# EAGLE schematic harp expander (EAGLE 9.5.1)
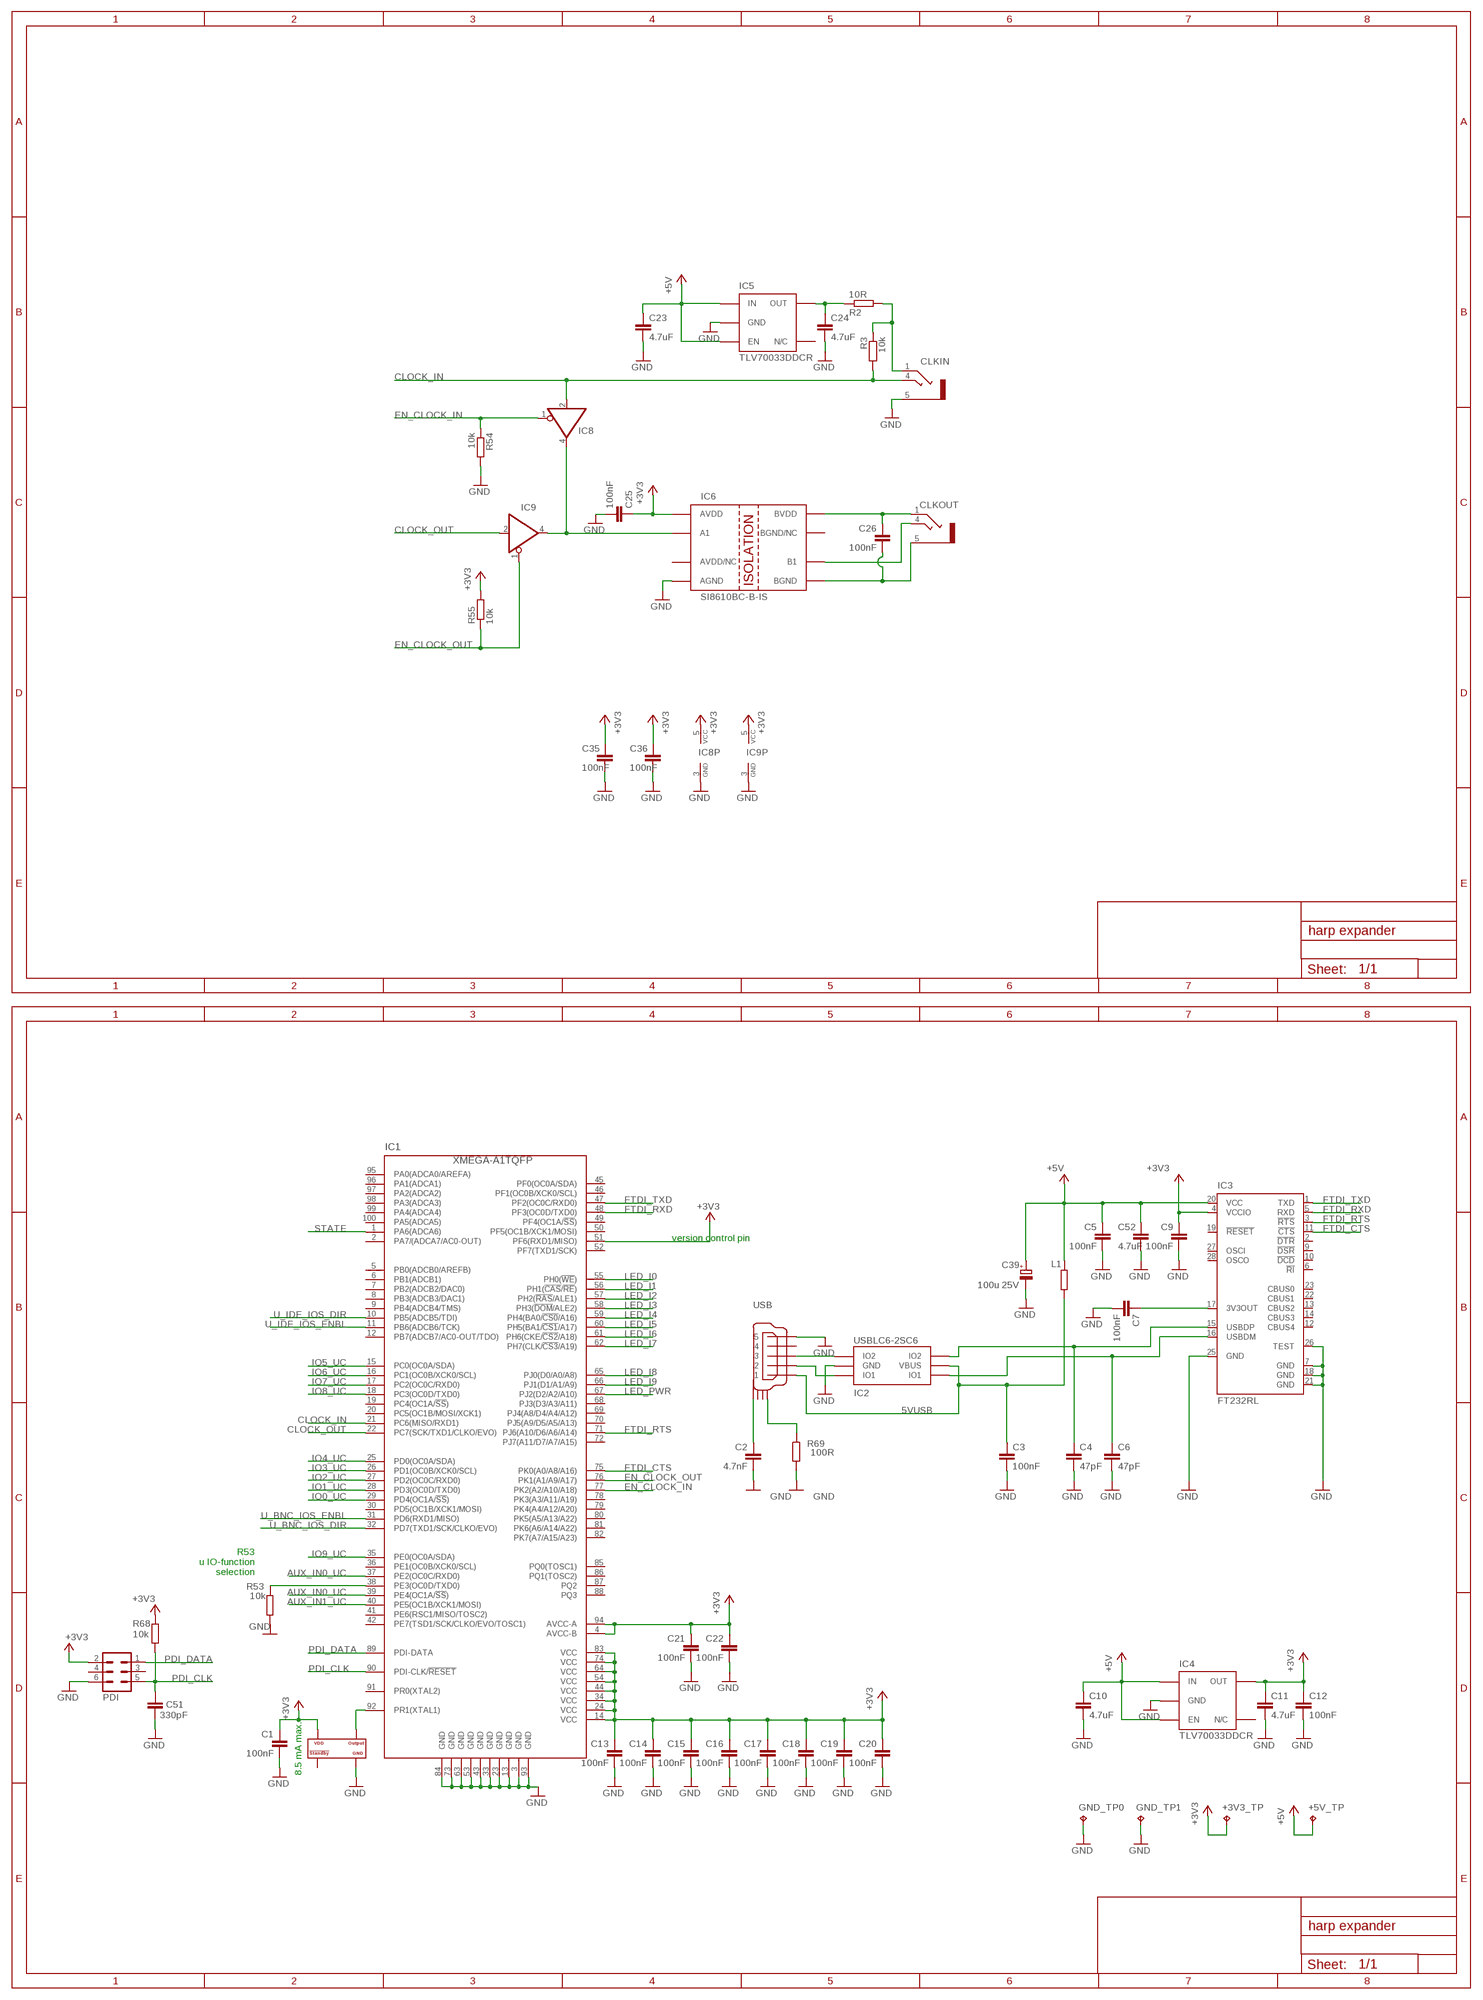
[diagram p0: schematic, sheet 1, part 1 of 2]
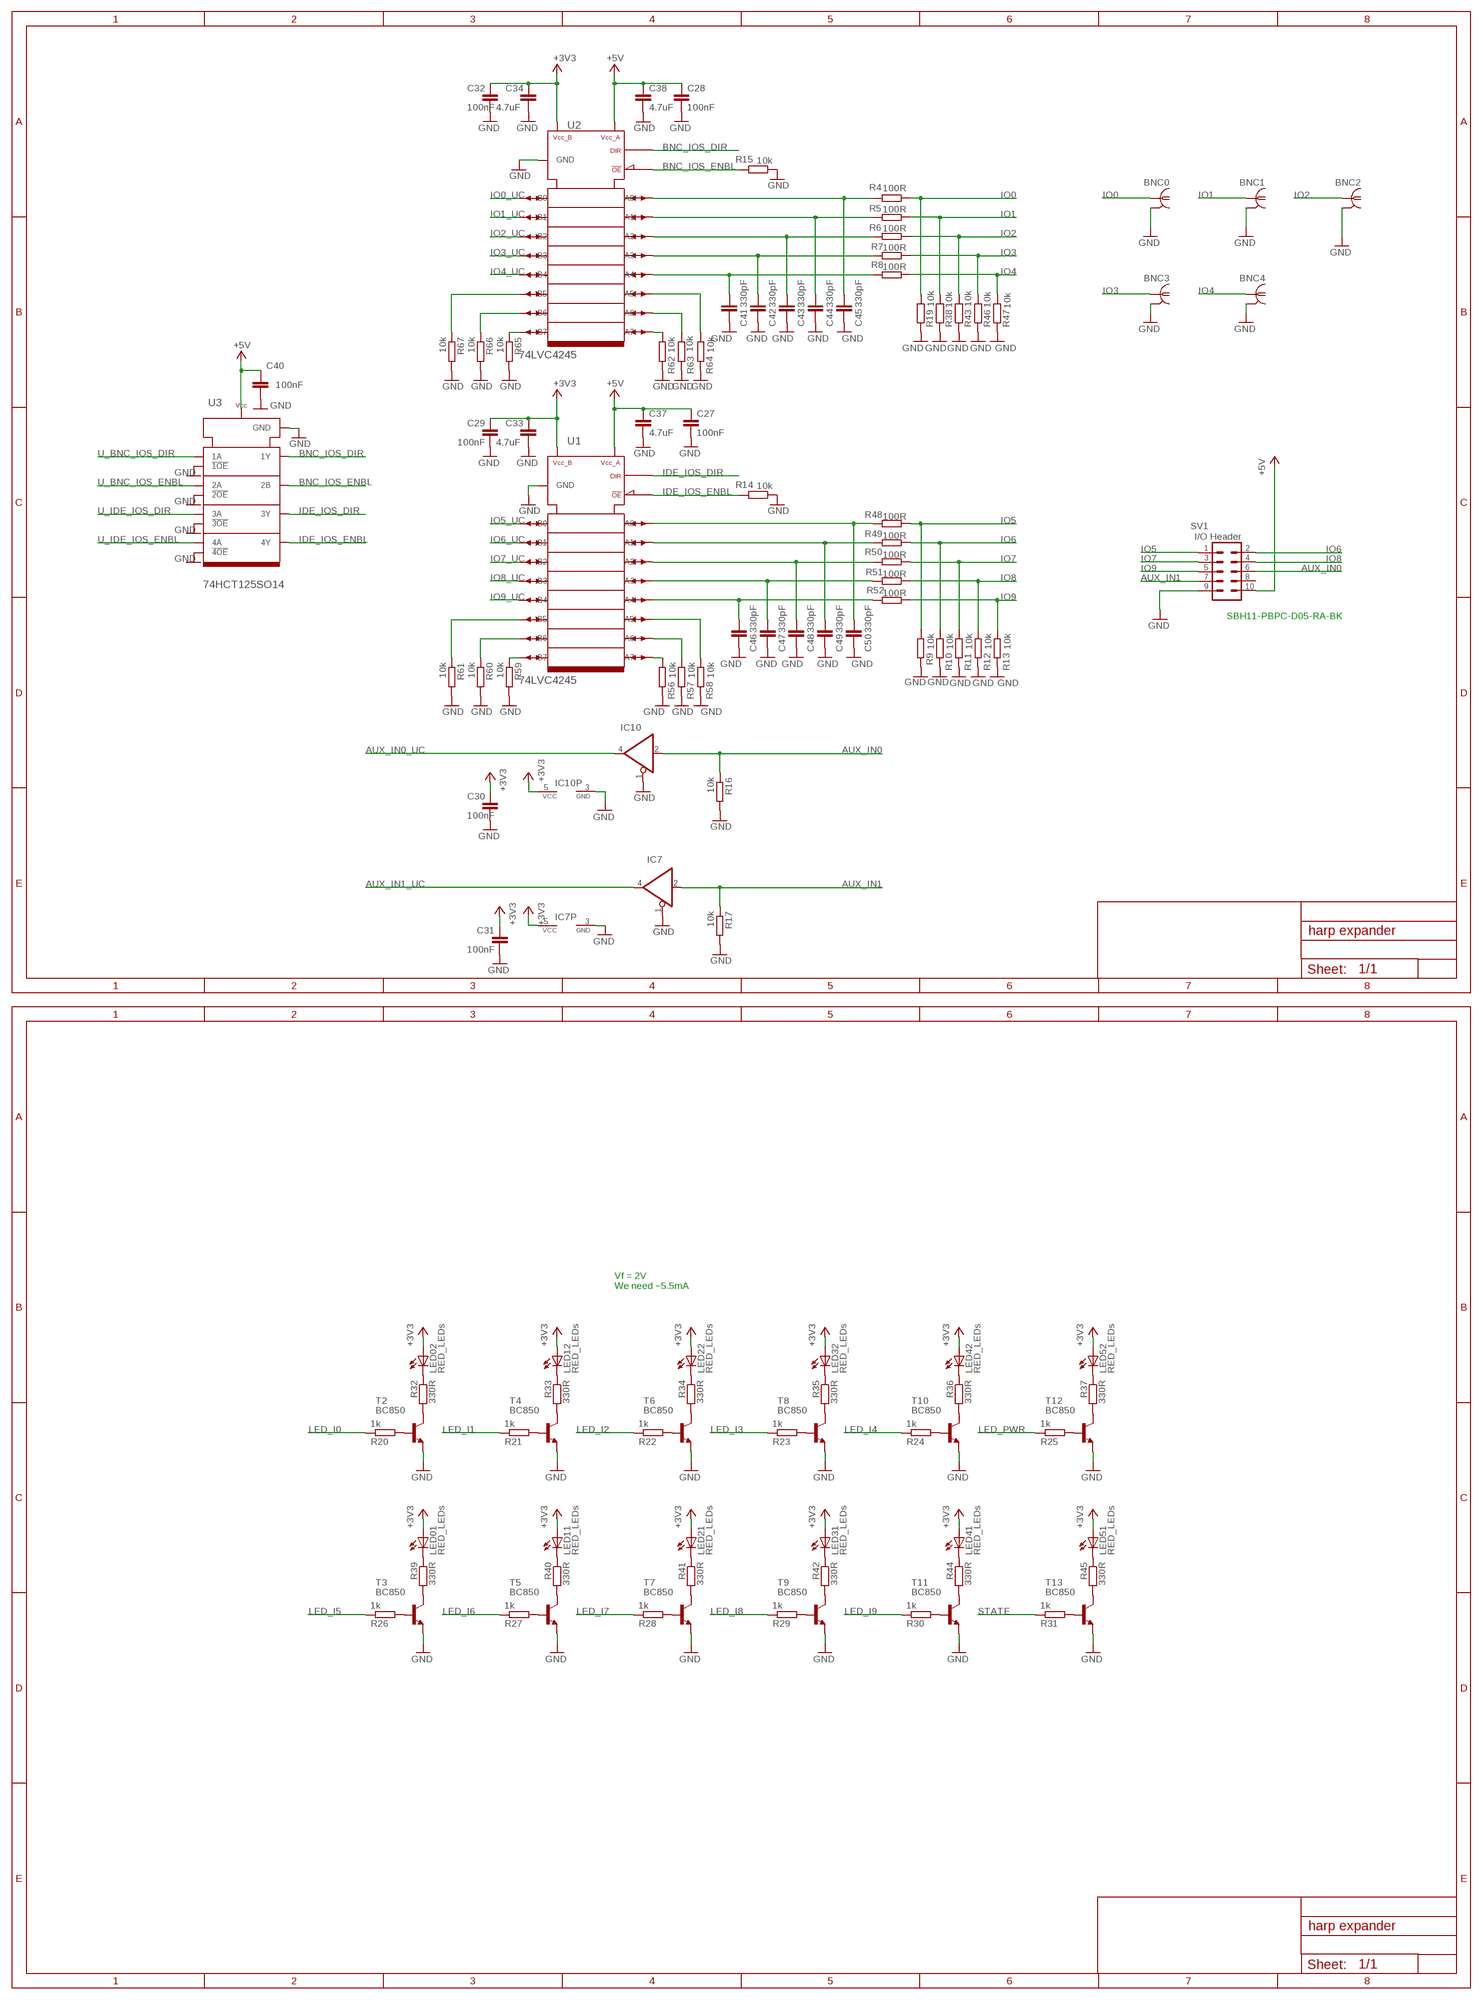
[diagram p1: schematic, sheet 1, part 2 of 2]

## Parts
+3V3_TP  TPPAD1-13  [P1-13]
+5V_TP  TPPAD1-13  [P1-13]
BNC0  BNC plug  BNC_0731000105  [0731000105]
BNC1  BNC plug  BNC_0731000105  [0731000105]
BNC2  BNC plug  BNC_0731000105  [0731000105]
BNC3  BNC plug  BNC_0731000105  [0731000105]
BNC4  BNC plug  BNC_0731000105  [0731000105]
C1  100nF  C-EUC0402  [C0402]
C2  4.7nF  C-EUC0402  [C0402]
C3  100nF  C-EUC0402  [C0402]
C4  47pF  C-EUC0402  [C0402]
C5  100nF  C-EUC0402  [C0402]
C6  47pF  C-EUC0402  [C0402]
C7  100nF  C-EUC0402  [C0402]
C9  100nF  C-EUC0402  [C0402]
C10  4.7uF  C-EUC0603  [C0603]
C11  4.7uF  C-EUC0603  [C0603]
C12  100nF  C-EUC0402  [C0402]
C13  100nF  C-EUC0402  [C0402]
C14  100nF  C-EUC0402  [C0402]
C15  100nF  C-EUC0402  [C0402]
C16  100nF  C-EUC0402  [C0402]
C17  100nF  C-EUC0402  [C0402]
C18  100nF  C-EUC0402  [C0402]
C19  100nF  C-EUC0402  [C0402]
C20  100nF  C-EUC0402  [C0402]
C21  100nF  C-EUC0402  [C0402]
C22  100nF  C-EUC0402  [C0402]
C23  4.7uF  C-EUC0603  [C0603]
C24  4.7uF  C-EUC0603  [C0603]
C25  100nF  C-EUC0402  [C0402]
C26  100nF  C-EUC0402  [C0402]
C27  100nF  C-EUC0402  [C0402]
C28  100nF  C-EUC0402  [C0402]
C29  100nF  C-EUC0402  [C0402]
C30  100nF  C-EUC0402  [C0402]
C31  100nF  C-EUC0402  [C0402]
C32  100nF  C-EUC0402  [C0402]
C33  4.7uF  C-EUC0603  [C0603]
C34  4.7uF  C-EUC0603  [C0603]
C35  100nF  C-EUC0402  [C0402]
C36  100nF  C-EUC0402  [C0402]
C37  4.7uF  C-EUC0603  [C0603]
C38  4.7uF  C-EUC0603  [C0603]
C39  100u 25V  CPOL-EUTT2D6  [TT2D6]
C40  100nF  C-EUC0402  [C0402]
C41  330pF  C-EUC0402  [C0402]
C42  330pF  C-EUC0402  [C0402]
C43  330pF  C-EUC0402  [C0402]
C44  330pF  C-EUC0402  [C0402]
C45  330pF  C-EUC0402  [C0402]
C46  330pF  C-EUC0402  [C0402]
C47  330pF  C-EUC0402  [C0402]
C48  330pF  C-EUC0402  [C0402]
C49  330pF  C-EUC0402  [C0402]
C50  330pF  C-EUC0402  [C0402]
C51  330pF  C-EUC0402  [C0402]
C52  4.7uF  C-EUC0603  [C0603]
CLKIN  CLCK_JACK  STEREO_JACK  [35RASMT2BHNTRX]
CLKOUT  CLCK_JACK  STEREO_JACK  [35RASMT2BHNTRX]
GND_TP0  TPPAD1-13  [P1-13]
GND_TP1  TPPAD1-13  [P1-13]
IC1  XMEGA-A1TQFP  [TQFP100]
IC2  USBLC6-2SC6  USBLC6-2  [SOT23-6L]
IC3  FT232RL  [SSOP28]
IC4  TLV70033DDCR  TLV700XX  [TSOT23-5]
IC5  TLV70033DDCR  TLV700XX  [TSOT23-5]
IC6  SI8610BC-B-IS  SI8610  [SO-08]
IC7  SN74LVC1G125DBVT  74AHC1G125DBV  [SOT23-5]
IC8  SN74LVC1G125DBVT  74AHC1G125DBV  [SOT23-5]
IC9  SN74LVC1G125DBVT  74AHC1G125DBV  [SOT23-5]
IC10  SN74LVC1G125DBVT  74AHC1G125DBV  [SOT23-5]
L1  40R@100MHz  R-EU_R0805  [R0805]
LED0  RED_LEDs  LED_2X_VERTICAL  [569-011X-X00_LED_ARRAY]
LED1  RED_LEDs  LED_2X_VERTICAL  [569-011X-X00_LED_ARRAY]
LED2  RED_LEDs  LED_2X_VERTICAL  [569-011X-X00_LED_ARRAY]
LED3  RED_LEDs  LED_2X_VERTICAL  [569-011X-X00_LED_ARRAY]
LED4  RED_LEDs  LED_2X_VERTICAL  [569-011X-X00_LED_ARRAY]
LED5  RED_LEDs  LED_2X_VERTICAL  [569-011X-X00_LED_ARRAY]
OSC  Oscillator  OSCILLATOR  [OSCILLATOR_3.2X2.5]
PDI  PROG HEADER  MA03-2  [MA03-2]
R2  10R  R-EU_R0402  [R0402]
R3  10k  R-EU_R0402  [R0402]
R4  100R  R-EU_R0603  [R0603]
R5  100R  R-EU_R0603  [R0603]
R6  100R  R-EU_R0603  [R0603]
R7  100R  R-EU_R0603  [R0603]
R8  100R  R-EU_R0603  [R0603]
R9  10k  R-EU_R0402  [R0402]
R10  10k  R-EU_R0402  [R0402]
R11  10k  R-EU_R0402  [R0402]
R12  10k  R-EU_R0402  [R0402]
R13  10k  R-EU_R0402  [R0402]
R14  10k  R-EU_R0402  [R0402]
R15  10k  R-EU_R0402  [R0402]
R16  10k  R-EU_R0402  [R0402]
R17  10k  R-EU_R0402  [R0402]
R19  10k  R-EU_R0402  [R0402]
R20  1k  R-EU_R0402  [R0402]
R21  1k  R-EU_R0402  [R0402]
R22  1k  R-EU_R0402  [R0402]
R23  1k  R-EU_R0402  [R0402]
R24  1k  R-EU_R0402  [R0402]
R25  1k  R-EU_R0402  [R0402]
R26  1k  R-EU_R0402  [R0402]
R27  1k  R-EU_R0402  [R0402]
R28  1k  R-EU_R0402  [R0402]
R29  1k  R-EU_R0402  [R0402]
R30  1k  R-EU_R0402  [R0402]
R31  1k  R-EU_R0402  [R0402]
R32  330R  R-EU_R0402  [R0402]
R33  330R  R-EU_R0402  [R0402]
R34  330R  R-EU_R0402  [R0402]
R35  330R  R-EU_R0402  [R0402]
R36  330R  R-EU_R0402  [R0402]
R37  330R  R-EU_R0402  [R0402]
R38  10k  R-EU_R0402  [R0402]
R39  330R  R-EU_R0402  [R0402]
R40  330R  R-EU_R0402  [R0402]
R41  330R  R-EU_R0402  [R0402]
R42  330R  R-EU_R0402  [R0402]
R43  10k  R-EU_R0402  [R0402]
R44  330R  R-EU_R0402  [R0402]
R45  330R  R-EU_R0402  [R0402]
R46  10k  R-EU_R0402  [R0402]
R47  10k  R-EU_R0402  [R0402]
R48  100R  R-EU_R0603  [R0603]
R49  100R  R-EU_R0603  [R0603]
R50  100R  R-EU_R0603  [R0603]
R51  100R  R-EU_R0603  [R0603]
R52  100R  R-EU_R0603  [R0603]
R53  10k  R-EU_R0402  [R0402]
R54  10k  R-EU_R0402  [R0402]
R55  10k  R-EU_R0402  [R0402]
R56  10k  R-EU_R0402  [R0402]
R57  10k  R-EU_R0402  [R0402]
R58  10k  R-EU_R0402  [R0402]
R59  10k  R-EU_R0402  [R0402]
R60  10k  R-EU_R0402  [R0402]
R61  10k  R-EU_R0402  [R0402]
R62  10k  R-EU_R0402  [R0402]
R63  10k  R-EU_R0402  [R0402]
R64  10k  R-EU_R0402  [R0402]
R65  10k  R-EU_R0402  [R0402]
R66  10k  R-EU_R0402  [R0402]
R67  10k  R-EU_R0402  [R0402]
R68  10k  R-EU_R0402  [R0402]
R69  100R  R-EU_R0603  [R0603]
SV1  I/O Header  ML10L  [ML10L]
T2  BC850  [SOT23]
T3  BC850  [SOT23]
T4  BC850  [SOT23]
T5  BC850  [SOT23]
T6  BC850  [SOT23]
T7  BC850  [SOT23]
T8  BC850  [SOT23]
T9  BC850  [SOT23]
T10  BC850  [SOT23]
T11  BC850  [SOT23]
T12  BC850  [SOT23]
T13  BC850  [SOT23]
U1  744245X  [SO24L]
U2  744245X  [SO24L]
U3  74HCT125SO14  [SO14]
USB  mini USB  USB_MINI_B  [240-0002-1]

## Nets
5VUSB: C3.1 IC2.P$5(VBUS) L1.2 USB.P$1
+3V3: +3V3_TP.TP C1.1 C9.1 C11.1 C12.1 C13.1 C14.1 C15.1 C16.1 C17.1 C18.1 C19.1 C20.1 C21.1 C22.1 C25.1 C29.1 C30.1 C31.1 C32.1 C33.1 C34.1 C35.1 C36.1 IC1.4(AVCC-B) IC1.14(VCC) IC1.24(VCC) IC1.34(VCC) IC1.44(VCC) IC1.51(PF6(RXD1/MISO)) IC1.54(VCC) IC1.64(VCC) IC1.74(VCC) IC1.83(VCC) IC1.94(AVCC-A) IC3.4(VCCIO) IC4.5(OUT) IC6.1(AVDD) IC7.5(VCC) IC8.5(VCC) IC9.5(VCC) IC10.5(VCC) LED0.A1(1:A) LED0.A2(2:A) LED1.A1(1:A) LED1.A2(2:A) LED2.A1(1:A) LED2.A2(2:A) LED3.A1(1:A) LED3.A2(2:A) LED4.A1(1:A) LED4.A2(2:A) LED5.A1(1:A) LED5.A2(2:A) OSC.P$4(VDD) PDI.2 R55.2 R68.2 U1.23(VCC_B) U1.24(VCC_B) U2.23(VCC_B) U2.24(VCC_B)
+5V: +5V_TP.TP C5.1 C10.1 C23.1 C27.1 C28.1 C37.1 C38.1 C39.+ C40.1 C52.1 IC3.20(VCC) IC4.1(IN) IC4.3(EN) IC5.1(IN) IC5.3(EN) L1.1 SV1.10 U1.1(VCC_A) U2.1(VCC_A) U3.14(VCC)
AUX_IN0: IC10.2(I) R16.1 SV1.6
AUX_IN0_UC: IC1.37(PE2(OC0C/RXD0)) IC1.39(PE4(OC1A/!SS!)) IC10.4(O)
AUX_IN1: IC7.2(I) R17.1 SV1.7
AUX_IN1_UC: IC1.40(PE5(OC1B/XCK1/MOSI)) IC7.4(O)
BNC_IOS_DIR: U2.2(DIR) U3.3(1Y)
BNC_IOS_ENBL: R15.2 U2.22(OE) U3.6(2B)
CLOCK_IN: CLKIN.4 IC1.21(PC6(MISO/RXD1)) IC8.2(I) R3.2
CLOCK_OUT: IC1.22(PC7(SCK/TXD1/CLKO/EVO)) IC9.2(I)
EN_CLOCK_IN: IC1.77(PK2(A2/A10/A18)) IC8.1(OE) R54.1
EN_CLOCK_OUT: IC1.76(PK1(A1/A9/A17)) IC9.1(OE) R55.1
FTDI_CTS: IC1.75(PK0(A0/A8/A16)) IC3.11(!CTS)
FTDI_RTS: IC1.71(PJ6(A10/D6/A6/A14)) IC3.3(!RTS)
FTDI_RXD: IC1.48(PF3(OC0D/TXD0)) IC3.5(RXD)
FTDI_TXD: IC1.47(PF2(OC0C/RXD0)) IC3.1(TXD)
GND: BNC0.2 BNC0.3 BNC1.2 BNC1.3 BNC2.2 BNC2.3 BNC3.2 BNC3.3 BNC4.2 BNC4.3 C1.2 C2.2 C3.2 C4.2 C5.2 C6.2 C7.2 C9.2 C10.2 C11.2 C12.2 C13.2 C14.2 C15.2 C16.2 C17.2 C18.2 C19.2 C20.2 C21.2 C22.2 C23.2 C24.2 C25.2 C27.2 C28.2 C29.2 C30.2 C31.2 C32.2 C33.2 C34.2 C35.2 C36.2 C37.2 C38.2 C39.- C40.2 C41.2 C42.2 C43.2 C44.2 C45.2 C46.2 C47.2 C48.2 C49.2 C50.2 C51.2 C52.2 CLKIN.5 GND_TP0.TP GND_TP1.TP IC1.3(GND) IC1.13(GND) IC1.23(GND) IC1.33(GND) IC1.43(GND) IC1.53(GND) IC1.63(GND) IC1.73(GND) IC1.84(GND) IC1.93(GND) IC2.P$2(GND) IC3.7(GND) IC3.18(GND) IC3.21(GND) IC3.25(GND) IC3.26(TEST) IC4.2(GND) IC5.2(GND) IC6.4(AGND) IC7.1(OE) IC7.3(GND) IC8.3(GND) IC9.3(GND) IC10.1(OE) IC10.3(GND) OSC.P$2(GND) PDI.6 R9.2 R10.2 R11.2 R12.2 R13.2 R14.1 R15.1 R16.2 R17.2 R19.1 R38.1 R43.1 R46.1 R47.1 R53.2 R54.2 R56.2 R57.2 R58.2 R59.2 R60.2 R61.2 R62.2 R63.2 R64.2 R65.2 R66.2 R67.2 R69.2 SV1.9 T2.2(E) T3.2(E) T4.2(E) T5.2(E) T6.2(E) T7.2(E) T8.2(E) T9.2(E) T10.2(E) T11.2(E) T12.2(E) T13.2(E) U1.11(GND) U1.12(GND) U1.13(GND) U2.11(GND) U2.12(GND) U2.13(GND) U3.1(!1OE) U3.4(!2OE) U3.7(GND) U3.10(!3OE) U3.13(!4OE) USB.P$5
GND_ISO: C26.2 CLKOUT.5 IC6.5(BGND)
IDE_IOS_DIR: U1.2(DIR) U3.8(3Y)
IDE_IOS_ENBL: R14.2 U1.22(OE) U3.11(4Y)
IO0 [IOss]: BNC0.1 R4.1 R19.2
IO0_UC: IC1.29(PD4(OC1A/!SS!)) U2.21(B0)
IO1 [IOss]: BNC1.1 R5.1 R38.2
IO1_UC: IC1.28(PD3(OC0D/TXD0)) U2.20(B1)
IO2 [IOss]: BNC2.1 R6.1 R43.2
IO2_UC: IC1.27(PD2(OC0C/RXD0)) U2.19(B2)
IO3 [IOss]: BNC3.1 R7.1 R46.2
IO3_UC: IC1.26(PD1(OC0B/XCK0/SCL)) U2.18(B3)
IO4 [IOss]: BNC4.1 R8.1 R47.2
IO4_UC: IC1.25(PD0(OC0A/SDA)) U2.17(B4)
IO5 [IOss]: R9.1 R48.1 SV1.1
IO5_UC: IC1.15(PC0(OC0A/SDA)) U1.21(B0)
IO6 [IOss]: R10.1 R49.1 SV1.2
IO6_UC: IC1.16(PC1(OC0B/XCK0/SCL)) U1.20(B1)
IO7 [IOss]: R11.1 R50.1 SV1.3
IO7_UC: IC1.17(PC2(OC0C/RXD0)) U1.19(B2)
IO8 [IOss]: R12.1 R51.1 SV1.4
IO8_UC: IC1.18(PC3(OC0D/TXD0)) U1.18(B3)
IO9 [IOss]: R13.1 R52.1 SV1.5
IO9_UC: IC1.35(PE0(OC0A/SDA)) U1.17(B4)
LED_I0: IC1.55(PH0(!WE!)) R20.1
LED_I1: IC1.56(PH1(!CAS!/!RE!)) R21.1
LED_I2: IC1.57(PH2(!RAS!/ALE1)) R22.1
LED_I3: IC1.58(PH3(!DOM!/ALE2)) R23.1
LED_I4: IC1.59(PH4(BA0/!CS0!/A16)) R24.1
LED_I5: IC1.60(PH5(BA1/!CS1!/A17)) R26.1
LED_I6: IC1.61(PH6(CKE/!CS2!/A18)) R27.1
LED_I7: IC1.62(PH7(CLK/!CS3!/A19)) R28.1
LED_I8: IC1.65(PJ0(D0/A0/A8)) R29.1
LED_I9: IC1.66(PJ1(D1/A1/A9)) R30.1
LED_PWR: IC1.67(PJ2(D2/A2/A10)) R25.1
N$1: R24.2 T10.1(B)
N$2: CLKOUT.4 IC6.6(B1)
N$3: R20.2 T2.1(B)
N$4: LED0.C2(2:C) R32.1
N$5: C26.1 CLKOUT.1 IC6.8(BVDD)
N$6 [IOss]: C50.1 R48.2 U1.3(A0)
N$7: R36.2 T10.3(C)
N$8: R32.2 T2.3(C)
N$9: IC1.38(PE3(OC0D/TXD0)) R53.1
N$14: R26.2 T3.1(B)
N$15: R22.2 T6.1(B)
N$16: R39.2 T3.3(C)
N$17: R21.2 T4.1(B)
N$18: LED3.C1(1:C) R42.1
N$19: R33.2 T4.3(C)
N$20: R27.2 T5.1(B)
N$21: R34.2 T6.3(C)
N$22: R40.2 T5.3(C)
N$23: LED3.C2(2:C) R35.1
N$24: R28.2 T7.1(B)
N$25: R41.2 T7.3(C)
N$26: R23.2 T8.1(B)
N$27: R35.2 T8.3(C)
N$28: R29.2 T9.1(B)
N$29: R42.2 T9.3(C)
N$30: LED1.C2(2:C) R33.1
N$31: LED2.C2(2:C) R34.1
N$32: LED1.C1(1:C) R40.1
N$33: LED2.C1(1:C) R41.1
N$34: R30.2 T11.1(B)
N$36: LED0.C1(1:C) R39.1
N$38: C7.1 IC3.17(3V3OUT)
N$40: IC2.P$1(IO1) USB.P$2
N$41: CLKIN.1 R2.2 R3.1
N$42: C24.1 IC5.5(OUT) R2.1
N$43: IC6.2(A1) IC8.4(O) IC9.4(O)
N$47: R44.2 T11.3(C)
N$50: IC2.P$3(IO2) USB.P$3
N$53: R25.2 T12.1(B)
N$54: R37.2 T12.3(C)
N$56: R31.2 T13.1(B)
N$59: C2.1 USB.SHIELD_4
N$60: R45.2 T13.3(C)
N$61: R69.1 USB.SHIELD_1
N$62: LED5.C1(1:C) R45.1
N$63: LED5.C2(2:C) R37.1
N$65: LED4.C2(2:C) R36.1
N$66: LED4.C1(1:C) R44.1
N$68: C49.1 R49.2 U1.4(A1)
N$69: C48.1 R50.2 U1.5(A2)
N$97: C47.1 R51.2 U1.6(A3)
N$114: C46.1 R52.2 U1.7(A4)
N$115 [IOss]: C45.1 R4.2 U2.3(A0)
N$116 [IOss]: C44.1 R5.2 U2.4(A1)
N$122 [IOss]: C43.1 R6.2 U2.5(A2)
N$140: R61.1 U1.16(B5)
N$142 [IOss]: C42.1 R7.2 U2.6(A3)
N$143: R60.1 U1.15(B6)
N$145: R59.1 U1.14(B7)
N$146 [IOss]: R56.1 U1.10(A7)
N$152 [IOss]: C41.1 R8.2 U2.7(A4)
N$165: R57.1 U1.9(A6)
N$166: R58.1 U1.8(A5)
N$167: R62.1 U2.10(A7)
N$169: R63.1 U2.9(A6)
N$170: R64.1 U2.8(A5)
N$171: R67.1 U2.16(B5)
N$172: R66.1 U2.15(B6)
N$173: R65.1 U2.14(B7)
OSC1: IC1.92(PR1(XTAL1)) OSC.P$3(OUTPUT)
PDI_CLK: C51.1 IC1.90(PDI-CLK/!RESET) PDI.5 R68.1
PDI_DATA: IC1.89(PDI-DATA) PDI.1
STATE: IC1.1(PA6(ADCA6)) R31.1
U_BNC_IOS_DIR: IC1.32(PD7(TXD1/SCK/CLKO/EVO)) U3.2(1A)
U_BNC_IOS_ENBL: IC1.31(PD6(RXD1/MISO)) U3.5(2A)
U_IDE_IOS_DIR: IC1.10(PB5(ADCB5/TDI)) U3.9(3A)
U_IDE_IOS_ENBL: IC1.11(PB6(ADCB6/TCK)) U3.12(4A)
USBDM: C6.1 IC2.P$6(IO1) IC3.16(USBDM)
USBDP: C4.1 IC2.P$4(IO2) IC3.15(USBDP)
Unconnected: IC1.2(PA7/(ADCA7/AC0-OUT)) IC1.5(PB0(ADCB0/AREFB)) IC1.6(PB1(ADCB1)) IC1.7(PB2(ADCB2/DAC0)) IC1.8(PB3(ADCB3/DAC1)) IC1.9(PB4(ADCB4/TMS)) IC1.12(PB7(ADCB7/AC0-OUT/TDO)) IC1.19(PC4(OC1A/!SS!)) IC1.20(PC5(OC1B/MOSI/XCK1)) IC1.30(PD5(OC1B/XCK1/MOSI)) IC1.36(PE1(OC0B/XCK0/SCL)) IC1.41(PE6(RSC1/MISO/TOSC2)) IC1.42(PE7(TSD1/SCK/CLKO/EVO/TOSC1)) IC1.45(PF0(OC0A/SDA)) IC1.46(PF1(OC0B/XCK0/SCL)) IC1.49(PF4(OC1A/!SS!)) IC1.50(PF5(OC1B/XCK1/MOSI)) IC1.52(PF7(TXD1/SCK)) IC1.68(PJ3(D3/A3/A11)) IC1.69(PJ4(A8/D4/A4/A12)) IC1.70(PJ5(A9/D5/A5/A13)) IC1.72(PJ7(A11/D7/A7/A15)) IC1.78(PK3(A3/A11/A19)) IC1.79(PK4(A4/A12/A20)) IC1.80(PK5(A5/A13/A22)) IC1.81(PK6(A6/A14/A22)) IC1.82(PK7(A7/A15/A23)) IC1.85(PQ0(TOSC1)) IC1.86(PQ1(TOSC2)) IC1.87(PQ2) IC1.88(PQ3) IC1.91(PR0(XTAL2)) IC1.95(PA0(ADCA0/AREFA)) IC1.96(PA1(ADCA1)) IC1.97(PA2(ADCA2)) IC1.98(PA3(ADCA3)) IC1.99(PA4(ADCA4)) IC1.100(PA5(ADCA5)) IC3.2(!DTR) IC3.6(!RI) IC3.9(!DSR) IC3.10(!DCD) IC3.12(CBUS4) IC3.13(CBUS2) IC3.14(CBUS3) IC3.19(!RESET) IC3.22(CBUS1) IC3.23(CBUS0) IC3.27(OSCI) IC3.28(OSCO) IC4.4(N/C) IC5.4(N/C) IC6.3(AVDD/NC) IC6.7(BGND/NC) OSC.P$1(STANDBY#) PDI.3 PDI.4 SV1.8 USB.P$4 USB.SHIELD_2 USB.SHIELD_3

## Notes on the sheet
- SBH11-PBPC-D05-RA-BK
- version control pin
- Vf = 2V
  We need ~5.5mA
- R53
  u IO-function
  selection
- 8.5 mA max.

## Library data of the parts
+3V3_TP +5V_TP GND_TP0 GND_TP1 = testpad:TP: Test pad; MPN: n.a.
BNC0 BNC1-BNC4 = jonnew:BNC: BNC CONNECTOR M/A COM www.macom.com distributor Farnell 149-452; MPN: 73100-0105; NOTES: -; TYPE: TH
C1 C3 C5 C7 C9 C12-C22 C25-C32 C35 C36 C40 = rcl:C-EU: CAPACITOR, European symbol; MPN: MC0402B104K160CT; NOTES: -; TYPE: SMD
C2 = rcl:C-EU: CAPACITOR, European symbol; MPN: 885012205084; NOTES: -; TYPE: SMD
C4 C6 = rcl:C-EU: CAPACITOR, European symbol; MPN: 04025A470JAT2A; NOTES: -; TYPE: SMD
C10 C11 C23 C24 C33 C34 C37 C38 C52 = rcl:C-EU: CAPACITOR, European symbol; MPN: C1608X6S1C475K080AC; NOTES: -; TYPE: SMD
C39 = rcl:CPOL-EU: POLARIZED CAPACITOR, European symbol; MPN: EEUFM1E101B; NOTES: -; TYPE: TH
C41-C51 = rcl:C-EU: CAPACITOR, European symbol; MPN: C0402C331J5GACTU; NOTES: -; TYPE: SMD
CLKIN CLKOUT = harp input expander:STEREO_JACK: CONN JACK STEREO 3.5MM SMD R/A; MPN: 35RASMT2BHNTRX; NOTES: -; TYPE: SMD
IC1 = avr-7:XMEGA-A1: Atmel XMega A1 Series processor; MPN: ATXMEGA128A1U-AU; TYPE: SMD
IC2 = harp input expander:USBLC6-2: TVS DIODE 5.25V 17V; MPN: USBLC6-2SC6; NOTES: -; TYPE: SMD
IC3 = harp input expander:FT232R: UART/FIFO IC; MPN: FT232RL-REEL; TYPE: SMD
IC4 = CNP:TLV700XX; MPN: TLV70033DDCR; NOTES: -; TYPE: SMD
IC5 = harp input expander:TLV700XX: C REG LINEAR 3.3V 200MA SOT23-5; MPN: TLV70033DDCR; NOTES: -; TYPE: SMD
IC6 = harp input expander:SI8610: DGTL ISO 3750VRMS 1CH GP 8SOIC; MPN: SI8610EC-B-IS; NOTES: -; TYPE: SMD
IC7-IC10 = 74xx-little-de:74*1G125: Single Bus Buffer Gate with 3-State Output; MPN: SN74LVC1G125DBVT; NOTES: -; TYPE: SMD
L1 = rcl:R-EU_: RESISTOR, European symbol; MPN: MI0805K400R-10; NOTES: -; TYPE: SMD
LED0 LED1-LED5 = harp input expander:LED_2X: LED 2HI 3MM NARROW RED PC MNT; MPN: 5690-111-100F; NOTES: -; TYPE: TH
OSC = harp input expander:OSCILLATOR: XTAL OSC TCXO 32.0000MHZ HCMOS; MPN: O 32,0-JT32C-A-K-3,3-LF; NOTES: Alternative: DSC1001CI5-032.0000T; TYPE: SMD
PDI = harp input expander:MA03-2: PIN HEADER; MPN: 67996-206HLF; NOTES: -; TYPE: TH
R2 = rcl:R-EU_: RESISTOR, European symbol; MPN: CRCW040210R0FKEDHP; NOTES: -; TYPE: SMD
R3 R9-R17 R19 R38 R43 R46 R47 R53-R68 = rcl:R-EU_: RESISTOR, European symbol; MPN: CRCW040210K0FKED; NOTES: -; TYPE: SMD
R4-R8 R48-R52 R69 = rcl:R-EU_: RESISTOR, European symbol; MPN: CRCW0603100RFKEAHP; NOTES: -; TYPE: SMD
R20-R31 = rcl:R-EU_: RESISTOR, European symbol; MPN: CRCW04021K00FKED; NOTES: -; TYPE: SMD
R32-R37 R39-R42 R44 R45 = rcl:R-EU_: RESISTOR, European symbol; MPN: RC0402FR-07330RL; NOTES: -; TYPE: SMD
SV1 = harp input expander:ML10L: HARTING; MPN: SBH11-PBPC-D05-RA-BK; NOTES: -; TYPE: TH
T2-T13 = transistor:BC850: NPN TRANSISTOR; MPN: BC850C,215; TYPE: SMD
U1 U2 = harp input expander:74*4245: Octal BUS TRANSCEIVER, 3-state; MPN: 74LVC4245AD,118; TYPE: SMD
U3 = harp input expander:74HCT125: Quad buffer/line driver; 3-state; MPN: 74HCT125D,653; TYPE: SMD
USB = harp input expander:USB_MINI_B: CONN RCPT USB2.0 MINI B SMD R/A; MPN: UX60-MB-5S8; NOTES: -; TYPE: SMD

## Net classes
0 default: clearance 0.205 mm
1 IOss: clearance 0.35 mm